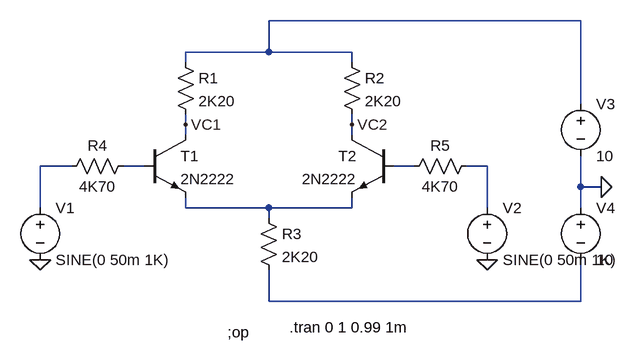
[diagram p0: schematic Prelab 1-5,6.asc]
Prelab 1-5,6.asc, the LTspice schematic file:
Version 4
SHEET 1 880 680
WIRE 736 -48 256 -48
WIRE 256 0 256 -48
WIRE 256 0 128 0
WIRE 384 0 256 0
WIRE 128 16 128 0
WIRE 384 16 384 0
WIRE 736 80 736 -48
WIRE 128 112 128 96
WIRE 384 112 384 96
WIRE 128 128 128 112
WIRE 384 128 384 112
WIRE -48 176 -96 176
WIRE 64 176 32 176
WIRE 480 176 448 176
WIRE 592 176 560 176
WIRE 736 208 736 160
WIRE 768 208 736 208
WIRE -96 240 -96 176
WIRE 128 240 128 224
WIRE 256 240 128 240
WIRE 384 240 384 224
WIRE 384 240 256 240
WIRE 592 240 592 176
WIRE 736 240 736 208
WIRE 256 256 256 240
WIRE 256 384 256 336
WIRE 736 384 736 320
WIRE 736 384 256 384
FLAG -96 320 0
FLAG 592 320 0
FLAG 768 208 0
FLAG 384 112 VC2
FLAG 128 112 VC1
SYMBOL res 112 0 R0
SYMATTR InstName R1
SYMATTR Value 2K20
SYMBOL res 368 0 R0
SYMATTR InstName R2
SYMATTR Value 2K20
SYMBOL res 240 240 R0
SYMATTR InstName R3
SYMATTR Value 2K20
SYMBOL res 48 160 R90
WINDOW 0 0 56 VBottom 2
WINDOW 3 32 56 VTop 2
SYMATTR InstName R4
SYMATTR Value 4K70
SYMBOL res 576 160 R90
WINDOW 0 0 56 VBottom 2
WINDOW 3 32 56 VTop 2
SYMATTR InstName R5
SYMATTR Value 4K70
SYMBOL npn 64 128 R0
SYMATTR InstName T1
SYMATTR Value 2N2222
SYMBOL npn 448 128 M0
SYMATTR InstName T2
SYMATTR Value 2N2222
SYMBOL voltage -96 224 R0
WINDOW 123 0 0 Left 0
WINDOW 39 0 0 Left 0
SYMATTR InstName V1
SYMATTR Value SINE(0 50m 1K)
SYMBOL voltage 592 224 R0
WINDOW 123 0 0 Left 0
WINDOW 39 0 0 Left 0
SYMATTR InstName V2
SYMATTR Value SINE(0 50m 1K)
SYMBOL voltage 736 64 R0
WINDOW 123 0 0 Left 0
WINDOW 39 0 0 Left 0
SYMATTR InstName V3
SYMATTR Value 10
SYMBOL voltage 736 224 R0
WINDOW 123 0 0 Left 0
WINDOW 39 0 0 Left 0
SYMATTR InstName V4
SYMATTR Value 10
TEXT 192 432 Left 2 !;op
TEXT 288 424 Left 2 !.tran 0 1 0.99 1m

The netlist it stands for:
* Prelab 1-5,6.asc
R1 N001 VC1 2K20
R2 N001 VC2 2K20
R3 N006 N007 2K20
R4 N003 N002 4K70
R5 N005 N004 4K70
Q§T1 VC1 N003 N006 0 2N2222
Q§T2 VC2 N004 N006 0 2N2222
V1 N002 0 SINE(0 50m 1K)
V2 N005 0 SINE(0 50m 1K)
V3 N001 0 10
V4 0 N007 10
.model NPN NPN
.model PNP PNP
.lib standard.bjt
;op
.tran 0 1 0.99 1m
.backanno
.end